# Altium project UMS.PrjPcb
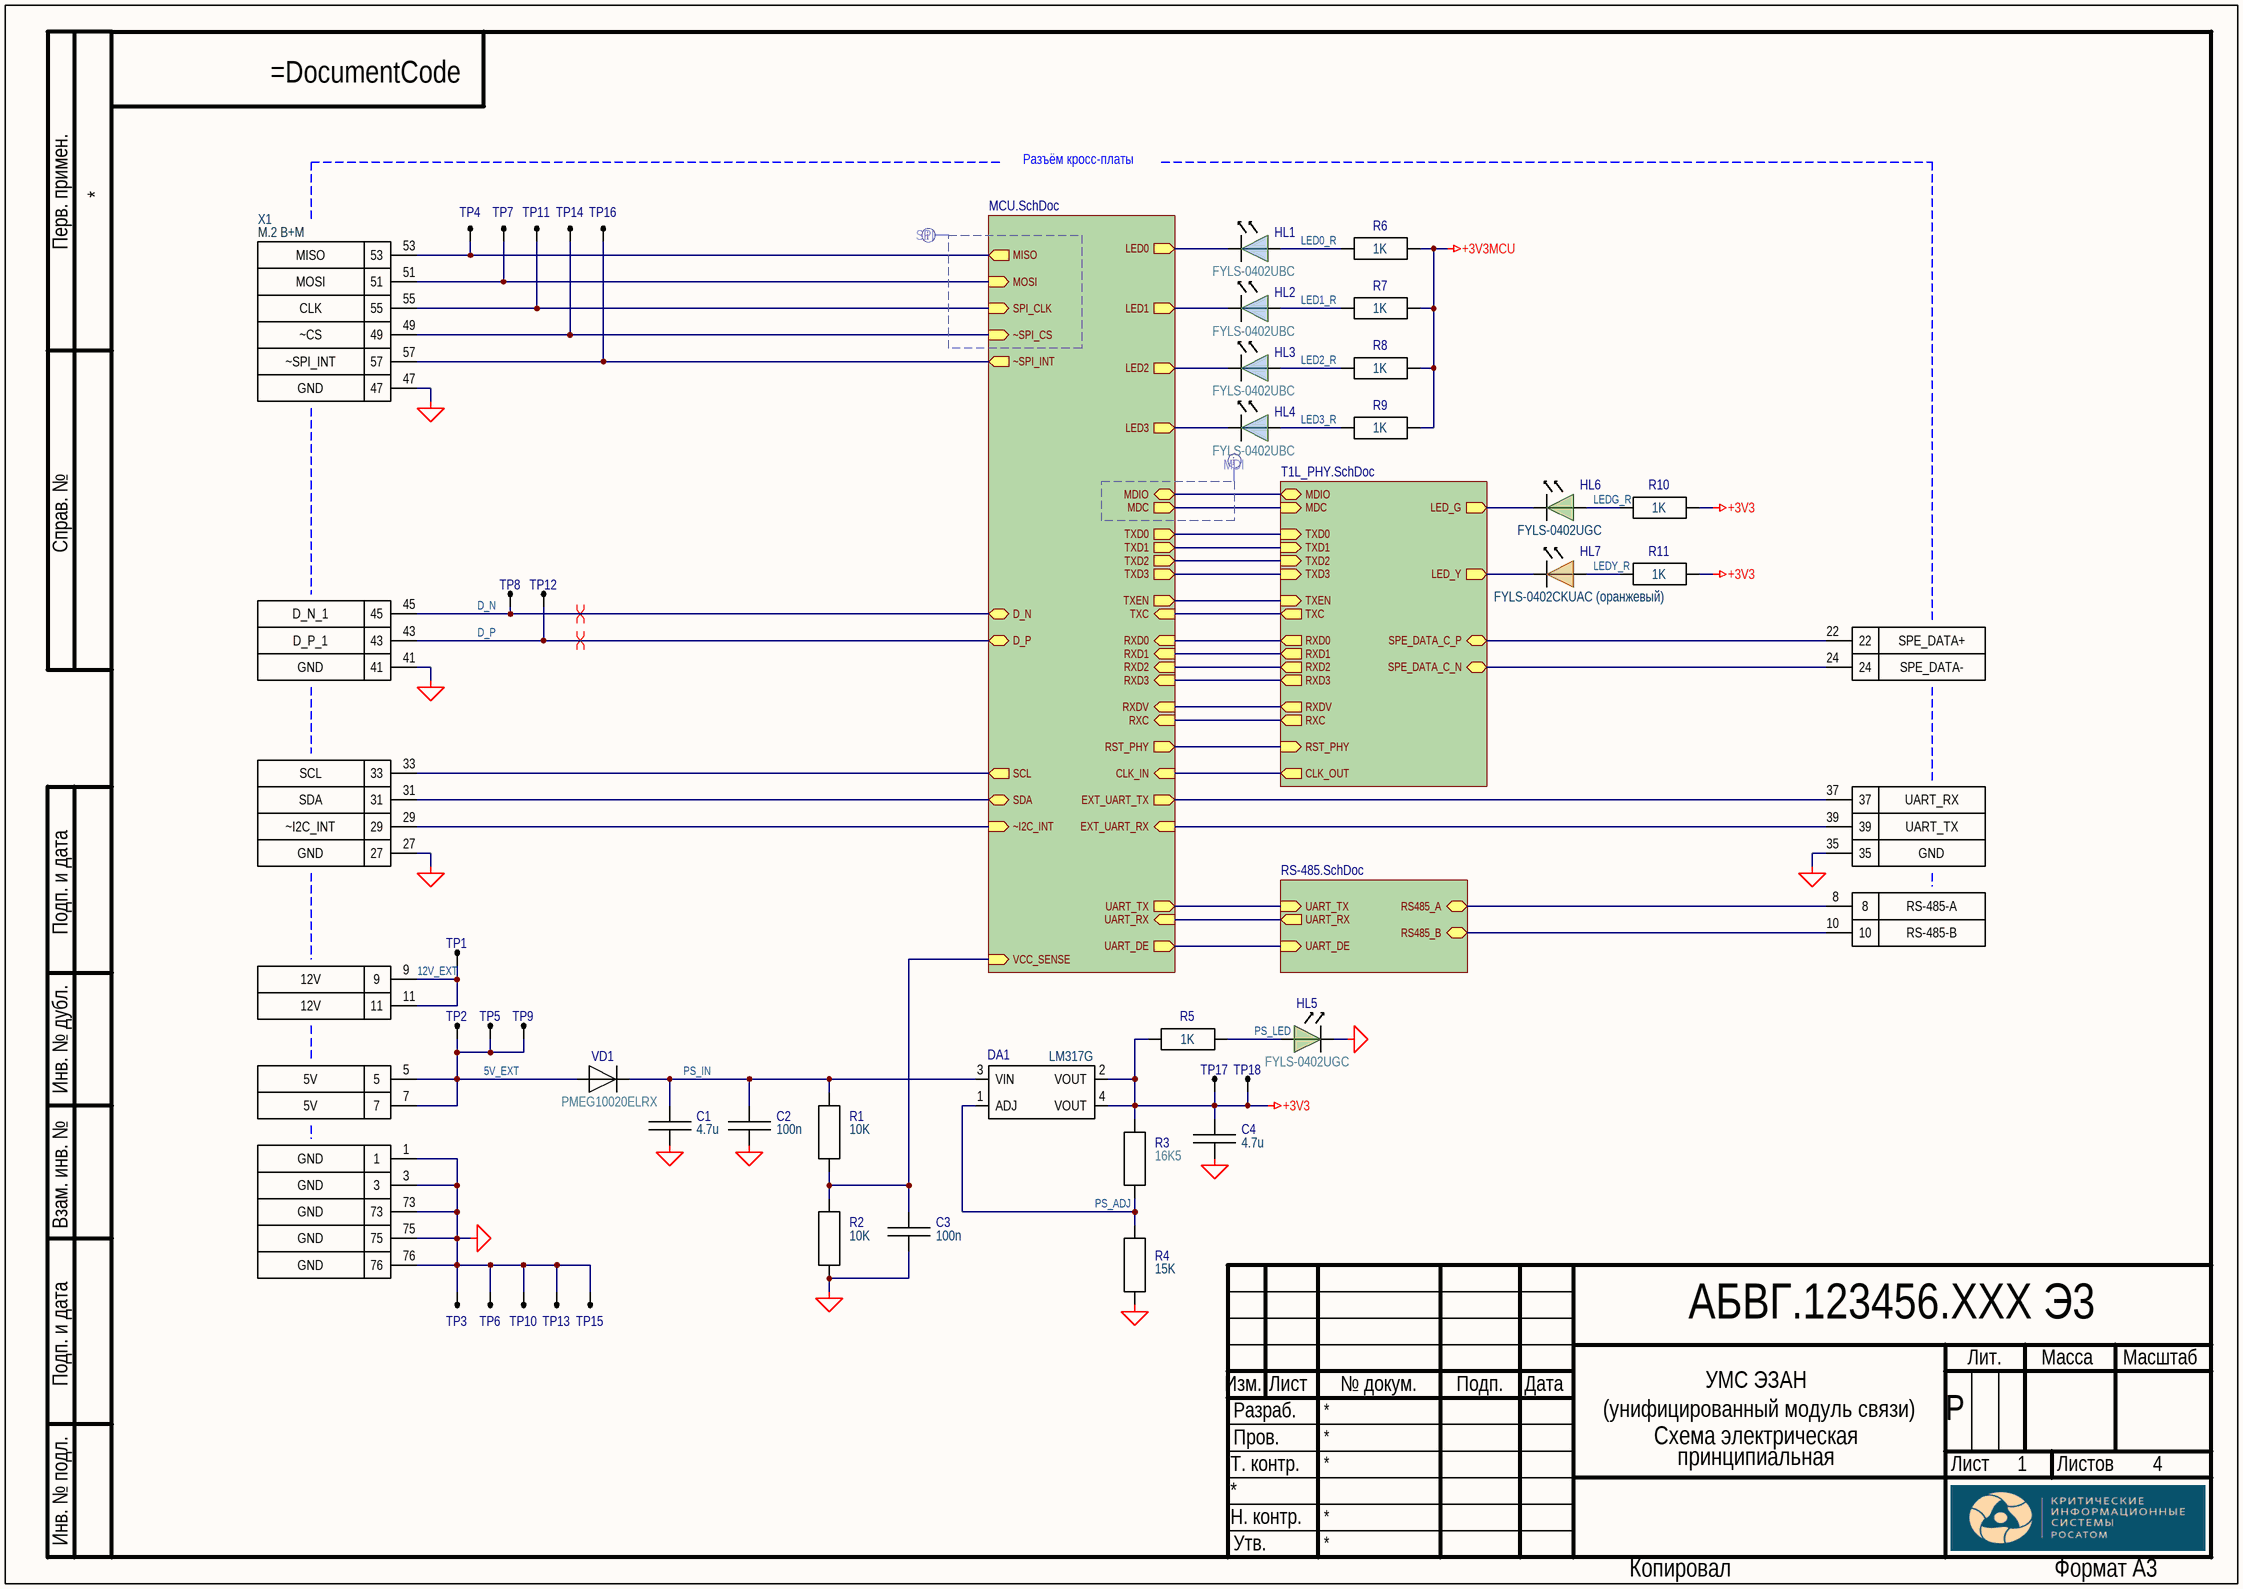
[diagram p0: Struct.SchDoc]
4 sheets, 198 parts. Net scope: hierarchical (ports join the sheet entries above them; power ports are global).
Board file: ums.PcbDoc
Sheets:
  Struct.SchDoc
    T1L = T1L_PHY.SchDoc
    RS-485 = RS-485.SchDoc
    MCU = MCU.SchDoc

## Sheet Struct.SchDoc
size 420 x 297 mm; DocumentNumber: АБВГ.123456.XXX Э3; SheetNumber: 1; SheetTotal: 4; Title1str: УМС ЭЗАН; PageSetup: Record=PageOptionsZCenterHorizontal=FalseZCenterVertical=FalseZPrintScale=0.95ZXCorrection=0.00ZYCorrection=0.00ZPrintKind=1ZBorderSize=5000000ZLeftOffset=0ZBottomOffset=0ZOrientation=1ZPaperLength=1000ZPaperWidth=1000ZScale=100ZPaperSource=15ZPrintQuality=600ZMediaType=1ZDitherType=10ZPaperKind=A4ZPrintScaleMode=1; Title2str: (унифицированный модуль связи); Letter1Column: Р; DocumentType1str: Схема электрическая; DocumentType2str: принципиальная; DocumentCode: АБВГ.123456.XXX Э3

### Parts
C1  4.7u  [C0603]
C2  100n  [C0402]
C3  100n  [C0402]
C4  4.7u  [C0603]
DA1  LM317G  [SOT-223]
HL1  FYLS-0402UBC  [LED_SMD_0402_blue]
HL2  FYLS-0402UBC  [LED_SMD_0402_blue]
HL3  FYLS-0402UBC  [LED_SMD_0402_blue]
HL4  FYLS-0402UBC  [LED_SMD_0402_blue]
HL5  FYLS-0402UGC  [LED_SMD_0402]
HL6  FYLS-0402UGC  [LED_SMD_0402]
HL7  FYLS-0402CKUAC (оранжевый)  [LED_SMD_0402_orange]
R1  10K  [R0402]
R2  10K  [R0402]
R3  16K5  [R0603]
R4  15K  [R0603]
R5  1K  [R0402]
R6  1K  [R0402]
R7  1K  [R0402]
R8  1K  [R0402]
R9  1K  [R0402]
R10  1K  [R0402]
R11  1K  [R0402]
TP1  TEST_POINT_SMD  [TEST_POINT_SMD]  (value not drawn)  (no BOM)
TP2  TEST_POINT_SMD  [TEST_POINT_SMD]  (value not drawn)  (no BOM)
TP3  TEST_POINT_1.27_STEP  [TEST_POINT_1.27_STEP]  (value not drawn)  (no BOM)
TP4  TEST_POINT_1.27_STEP  [TEST_POINT_1.27_STEP]  (value not drawn)  (no BOM)
TP5  TEST_POINT_1.27_STEP  [TEST_POINT_1.27_STEP]  (value not drawn)  (no BOM)
TP6  TEST_POINT_1.27_STEP  [TEST_POINT_1.27_STEP]  (value not drawn)  (no BOM)
TP7  TEST_POINT_1.27_STEP  [TEST_POINT_1.27_STEP]  (value not drawn)  (no BOM)
TP8  TEST_POINT_1.27_STEP  [TEST_POINT_1.27_STEP]  (value not drawn)  (no BOM)
TP9  TEST_POINT_1.27_STEP  [TEST_POINT_1.27_STEP]  (value not drawn)  (no BOM)
TP10  TEST_POINT_SMD  [TEST_POINT_SMD]  (value not drawn)  (no BOM)
TP11  TEST_POINT_1.27_STEP  [TEST_POINT_1.27_STEP]  (value not drawn)  (no BOM)
TP12  TEST_POINT_1.27_STEP  [TEST_POINT_1.27_STEP]  (value not drawn)  (no BOM)
TP13  TEST_POINT_1.27_STEP  [TEST_POINT_1.27_STEP]  (value not drawn)  (no BOM)
TP14  TEST_POINT_1.27_STEP  [TEST_POINT_1.27_STEP]  (value not drawn)  (no BOM)
TP15  TEST_POINT_1.27_STEP  [TEST_POINT_1.27_STEP]  (value not drawn)  (no BOM)
TP16  TEST_POINT_1.27_STEP  [TEST_POINT_1.27_STEP]  (value not drawn)  (no BOM)
TP17  TEST_POINT_1.27_STEP  [TEST_POINT_1.27_STEP]  (value not drawn)  (no BOM)
TP18  TEST_POINT_1.27_STEP  [TEST_POINT_1.27_STEP]  (value not drawn)  (no BOM)
VD1  PMEG10020ELRX  [SOD123W]
X1  M2_3030_M_Partial  [m2-3030-B+M]  (value not drawn)  (parts A,B,C,D,E,F,G,H,I,J,K,L,M,N,O,P,Q,R,S,T,U,V,W,X,Y,Z,27,28,29 of 29)

### Sub-sheets
MCU = MCU.SchDoc: VCC_SENSE (in), MDIO (bidir), MDC (out), RST_PHY (out), TXEN (out), TXC (in), RXDV (in), RXC (in), RXD0 (in), RXD1 (in), RXD2 (in), RXD3 (in), TXD0 (out), TXD1 (out), TXD2 (out), TXD3 (out), LED0 (out), LED3 (out), UART_TX (out), UART_RX (in), UART_DE (out), MISO (out), MOSI (in), SPI_CLK (in), ~SPI_CS (in), ~SPI_INT (out), D_N (bidir), D_P (bidir), LED1 (out), LED2 (out), CLK_IN (in), EXT_UART_TX (out), EXT_UART_RX (in), SDA (bidir), SCL (out), ~I2C_INT (in)
RS-485 = RS-485.SchDoc: RS485_A (bidir), RS485_B (bidir), UART_TX (in), UART_RX (out), UART_DE (in)
T1L = T1L_PHY.SchDoc: RST_PHY (in), LED_G (out), LED_Y (out), MDIO (bidir), MDC (in), TXEN (in), TXC (out), RXDV (out), RXC (out), SPE_DATA_C_P (bidir), SPE_DATA_C_N (bidir), RXD0 (out), RXD1 (out), RXD2 (out), RXD3 (out), TXD0 (in), TXD1 (in), TXD2 (in), TXD3 (in), CLK_OUT (out)

### Nets
+3V3: C4.1 DA1.2(VOUT) DA1.4(VOUT) R3.2 R5.1 R10.2 R11.2 TP17.1 TP18.1
+3V3MCU: R6.2 R7.2 R8.2 R9.2
GND: C1.2 C2.1 C3.1 C4.2 HL5.2 R2.1 R4.1 TP3.1 TP6.1 TP10.1 TP13.1 TP15.1 X1.1 X1.3 X1.27 X1.35 X1.41 X1.47 X1.73 X1.75 X1.76
LED_G: HL6.2 ; sheet T1L/LED_G
5V_EXT: TP2.1 TP5.1 TP9.1 VD1.2 X1.5 X1.7
12V_EXT: TP1.1 X1.9 X1.11
CLK_IN: sheet T1L/CLK_OUT, sheet MCU/CLK_IN
D_N: TP8.1 X1.45 ; sheet MCU/D_N
D_P: TP12.1 X1.43 ; sheet MCU/D_P
EXT_UART_RX: X1.39 ; sheet MCU/EXT_UART_RX
EXT_UART_TX: X1.37 ; sheet MCU/EXT_UART_TX
LED0: HL1.2 ; sheet MCU/LED0
LED0_R: HL1.1 R6.1
LED1: HL2.2 ; sheet MCU/LED1
LED1_R: HL2.1 R7.1
LED2: HL3.2 ; sheet MCU/LED2
LED2_R: HL3.1 R8.1
LED3: HL4.2 ; sheet MCU/LED3
LED3_R: HL4.1 R9.1
LED_Y: HL7.2 ; sheet T1L/LED_Y
LEDG_R: HL6.1 R10.1
LEDY_R: HL7.1 R11.1
MCURXD0: sheet T1L/RXD0, sheet MCU/RXD0
MCURXD1: sheet T1L/RXD1, sheet MCU/RXD1
MCURXD2: sheet T1L/RXD2, sheet MCU/RXD2
MCURXD3: sheet T1L/RXD3, sheet MCU/RXD3
MDC: sheet T1L/MDC, sheet MCU/MDC
MDIO: sheet T1L/MDIO, sheet MCU/MDIO
MISO: TP4.1 X1.53 ; sheet MCU/MISO
MOSI: TP7.1 X1.51 ; sheet MCU/MOSI
PS_ADJ: DA1.1(ADJ) R3.1 R4.2
PS_IN: C1.1 C2.2 DA1.3(VIN) R1.2 VD1.1
PS_LED: HL5.1 R5.2
RS485_A: X1.8 ; sheet RS-485/RS485_A
RS485_B: X1.10 ; sheet RS-485/RS485_B
RST_PHY: sheet T1L/RST_PHY, sheet MCU/RST_PHY
RXC: sheet T1L/RXC, sheet MCU/RXC
RXDV: sheet T1L/RXDV, sheet MCU/RXDV
SCL: X1.33 ; sheet MCU/SCL
SDA: X1.31 ; sheet MCU/SDA
SPE_DATA_C_N: X1.24 ; sheet T1L/SPE_DATA_C_N
SPE_DATA_C_P: X1.22 ; sheet T1L/SPE_DATA_C_P
SPI_CLK: TP11.1 X1.55 ; sheet MCU/SPI_CLK
TXC: sheet T1L/TXC, sheet MCU/TXC
TXD0: sheet T1L/TXD0, sheet MCU/TXD0
TXD1: sheet T1L/TXD1, sheet MCU/TXD1
TXD2: sheet T1L/TXD2, sheet MCU/TXD2
TXD3: sheet T1L/TXD3, sheet MCU/TXD3
TXEN: sheet T1L/TXEN, sheet MCU/TXEN
UART_DE: sheet RS-485/UART_DE, sheet MCU/UART_DE
UART_RX: sheet RS-485/UART_RX, sheet MCU/UART_RX
UART_TX: sheet RS-485/UART_TX, sheet MCU/UART_TX
VCC_SENSE: C3.2 R1.1 R2.2 ; sheet MCU/VCC_SENSE
~I2C_INT: X1.29 ; sheet MCU/~I2C_INT
~SPI_CS: TP14.1 X1.49 ; sheet MCU/~SPI_CS
~SPI_INT: TP16.1 X1.57 ; sheet MCU/~SPI_INT

### Layout directives
differential pair: D_N, D_P
net class SPI: (no net found under the mark)
net class MDI: (no net found under the mark)

### Notes on the sheet
- Разъём кросс-платы
- X1
- M.2 B+M
- Labels drawn without touching a wire or pin: =DocumentCode
- Перв. примен.
- Справ. №
- Подп. и дата
- Инв. № дубл.
- Взам. инв. №
- Изм.
- Лист
- № докум.
- Подп.
- Дата
- Лит.
- Масса
- Масштаб
- Т. контр.
- Пров.
- Разраб.
- Листов
- Инв. № подл.
- Н. контр.
- Утв.
- Копировал
- Формат А3
- (in symbol M2_3030_B+M_Partial, part A) GND
- (in symbol M2_3030_B+M_Partial, part B) RS-485-B
- (in symbol M2_3030_B+M_Partial, part C) GND
- (in symbol M2_3030_B+M_Partial, part D) RS-485-A
- (in symbol M2_3030_B+M_Partial, part E) 5V
- (in symbol M2_3030_B+M_Partial, part F) 5V
- (in symbol M2_3030_B+M_Partial, part G) 12V
- (in symbol M2_3030_B+M_Partial, part H) 12V
- (in symbol M2_3030_B+M_Partial, part I) SPE_DATA+
- (in symbol M2_3030_B+M_Partial, part J) SPE_DATA-
- (in symbol M2_3030_B+M_Partial, part K) GND
- (in symbol M2_3030_B+M_Partial, part L) D_P_1
- (in symbol M2_3030_B+M_Partial, part M) D_N_1
- (in symbol M2_3030_B+M_Partial, part N) GND
- (in symbol M2_3030_B+M_Partial, part O) ~CS
- (in symbol M2_3030_B+M_Partial, part P) MOSI
- (in symbol M2_3030_B+M_Partial, part Q) MISO
- (in symbol M2_3030_B+M_Partial, part R) ~SPI_INT
- (in symbol M2_3030_B+M_Partial, part S) GND
- (in symbol M2_3030_B+M_Partial, part T) GND
- (in symbol M2_3030_B+M_Partial, part U) CLK
- (in symbol M2_3030_B+M_Partial, part V) GND
- (in symbol M2_3030_B+M_Partial, part W) UART_TX
- (in symbol M2_3030_B+M_Partial, part X) UART_RX
- (in symbol M2_3030_B+M_Partial, part Y) GND
- (in symbol M2_3030_B+M_Partial, part Z) SCL
- (in symbol M2_3030_B+M_Partial, part 27) SDA
- (in symbol M2_3030_B+M_Partial, part 28) ~I2C_INT
- (in symbol M2_3030_B+M_Partial, part 29) GND

### Library data of the parts
C1 C4 = C0603: Чип-конденсатор 4,7 мкФ 10% 16 В X5R 0603; Manufacturer Part Number: CC0603KRX5R7BB475; Manufacturer: Yageo; TYPE: Чип-конденсатор 0603; Value: 4,7 мкФ 10% 16 В X5R; Component Type: Конденсатор
C2 C3 = C0402: Чип-конденсатор 100 нФ 10% 50 В X7R 0402; Manufacturer Part Number: CC0402KRX7R9BB104; Manufacturer: Yageo; Value: 100 нФ 10% 50 В X7R; Component Type: Конденсатор
DA1 = LM317G: LDO-регулятор SOT-223; Manufacturer: UMW; Manufacturer Part Number: LM317G; Component Type: Микросхема
HL1-HL4 = FYLS-0402UBC: Светодиод SMD 0402 прямой синий FYLS-0402UBC; Manufacturer: Foryard; Part Number: FYLS-0402UBC; Component Type: Светодиод; Manufacturer Part Number: FYLS-0402UBC
HL5 HL6 = FYLS-0402UGC: Светодиод SMD 0402 прямой зелёный FYLS-0402UGC; Manufacturer: Foryard; Manufacturer Part Number: FYLS-0402UGC; Component Type: Светодиод
HL7 = FYLS-0402CKUAC: Светодиод SMD 0402 прямой оранжевый 0402; Manufacturer: Foryard; Manufacturer Part Number: FYLS-0402CKUAC; Component Type: Светодиод
R1 R2 = R0402_1: Чип-резистор 10 кОм 1% 0402; Manufacturer Part Number: RC0402FR-0710KL; Manufacturer: Yageo; Value: 10 кОм 1%; Component Type: Резистор
R3 = R0603_3: Чип-резистор 16,5 кОм 1% 0603; Manufacturer Part Number: RC0603FR-0716K5L; Manufacturer: Yageo; TYPE: Чип-резистор 0603; Value: 16,5 кОм 1%; Component Type: Резистор
R4 = R0603_23: Чип-резистор 15 кОм 1% 0603; Manufacturer Part Number: RC0603FR-0715KL; Manufacturer: Yageo; TYPE: Чип-резистор 0603; Value: 15 кОм 1%; Component Type: Резистор
R5-R11 = R0402_4: Чип-резистор 1 кОм 1% 0402; Manufacturer Part Number: RC0402FR-071KL; Manufacturer: Yageo; Value: 1 кОм 1%; Component Type: Резистор
TP1 TP2 TP10 = TEST_POINT_SMD: Контрольная точка SMD
TP3-TP9 TP11-TP18 = TEST_POINT_1.27_STEP: Контрольная точка SMD
VD1 = PMEG10020ELRX: Диод Шоттки SOD123W; Manufacturer: Nexperia; Manufacturer Part Number: PMEG10020ELRX; Component Type: Диод
X1 = M2_3030_B+M_Partial: Parameter 1: *

## Sheet T1L_PHY.SchDoc
size 420 x 297 mm; DocumentNumber: АБВГ.123456.XXX Э3; SheetNumber: 3; SheetTotal: 4; PageSetup: Record=PageOptionsZCenterHorizontal=FalseZCenterVertical=FalseZPrintScale=0.95ZXCorrection=0.00ZYCorrection=0.00ZPrintKind=1ZBorderSize=5000000ZLeftOffset=0ZBottomOffset=0ZOrientation=1ZPaperLength=1000ZPaperWidth=1000ZScale=100ZPaperSource=15ZPrintQuality=600ZMediaType=1ZDitherType=10ZPaperKind=A4ZPrintScaleMode=1; DocumentCode: АБВГ.123456.XXX Э3
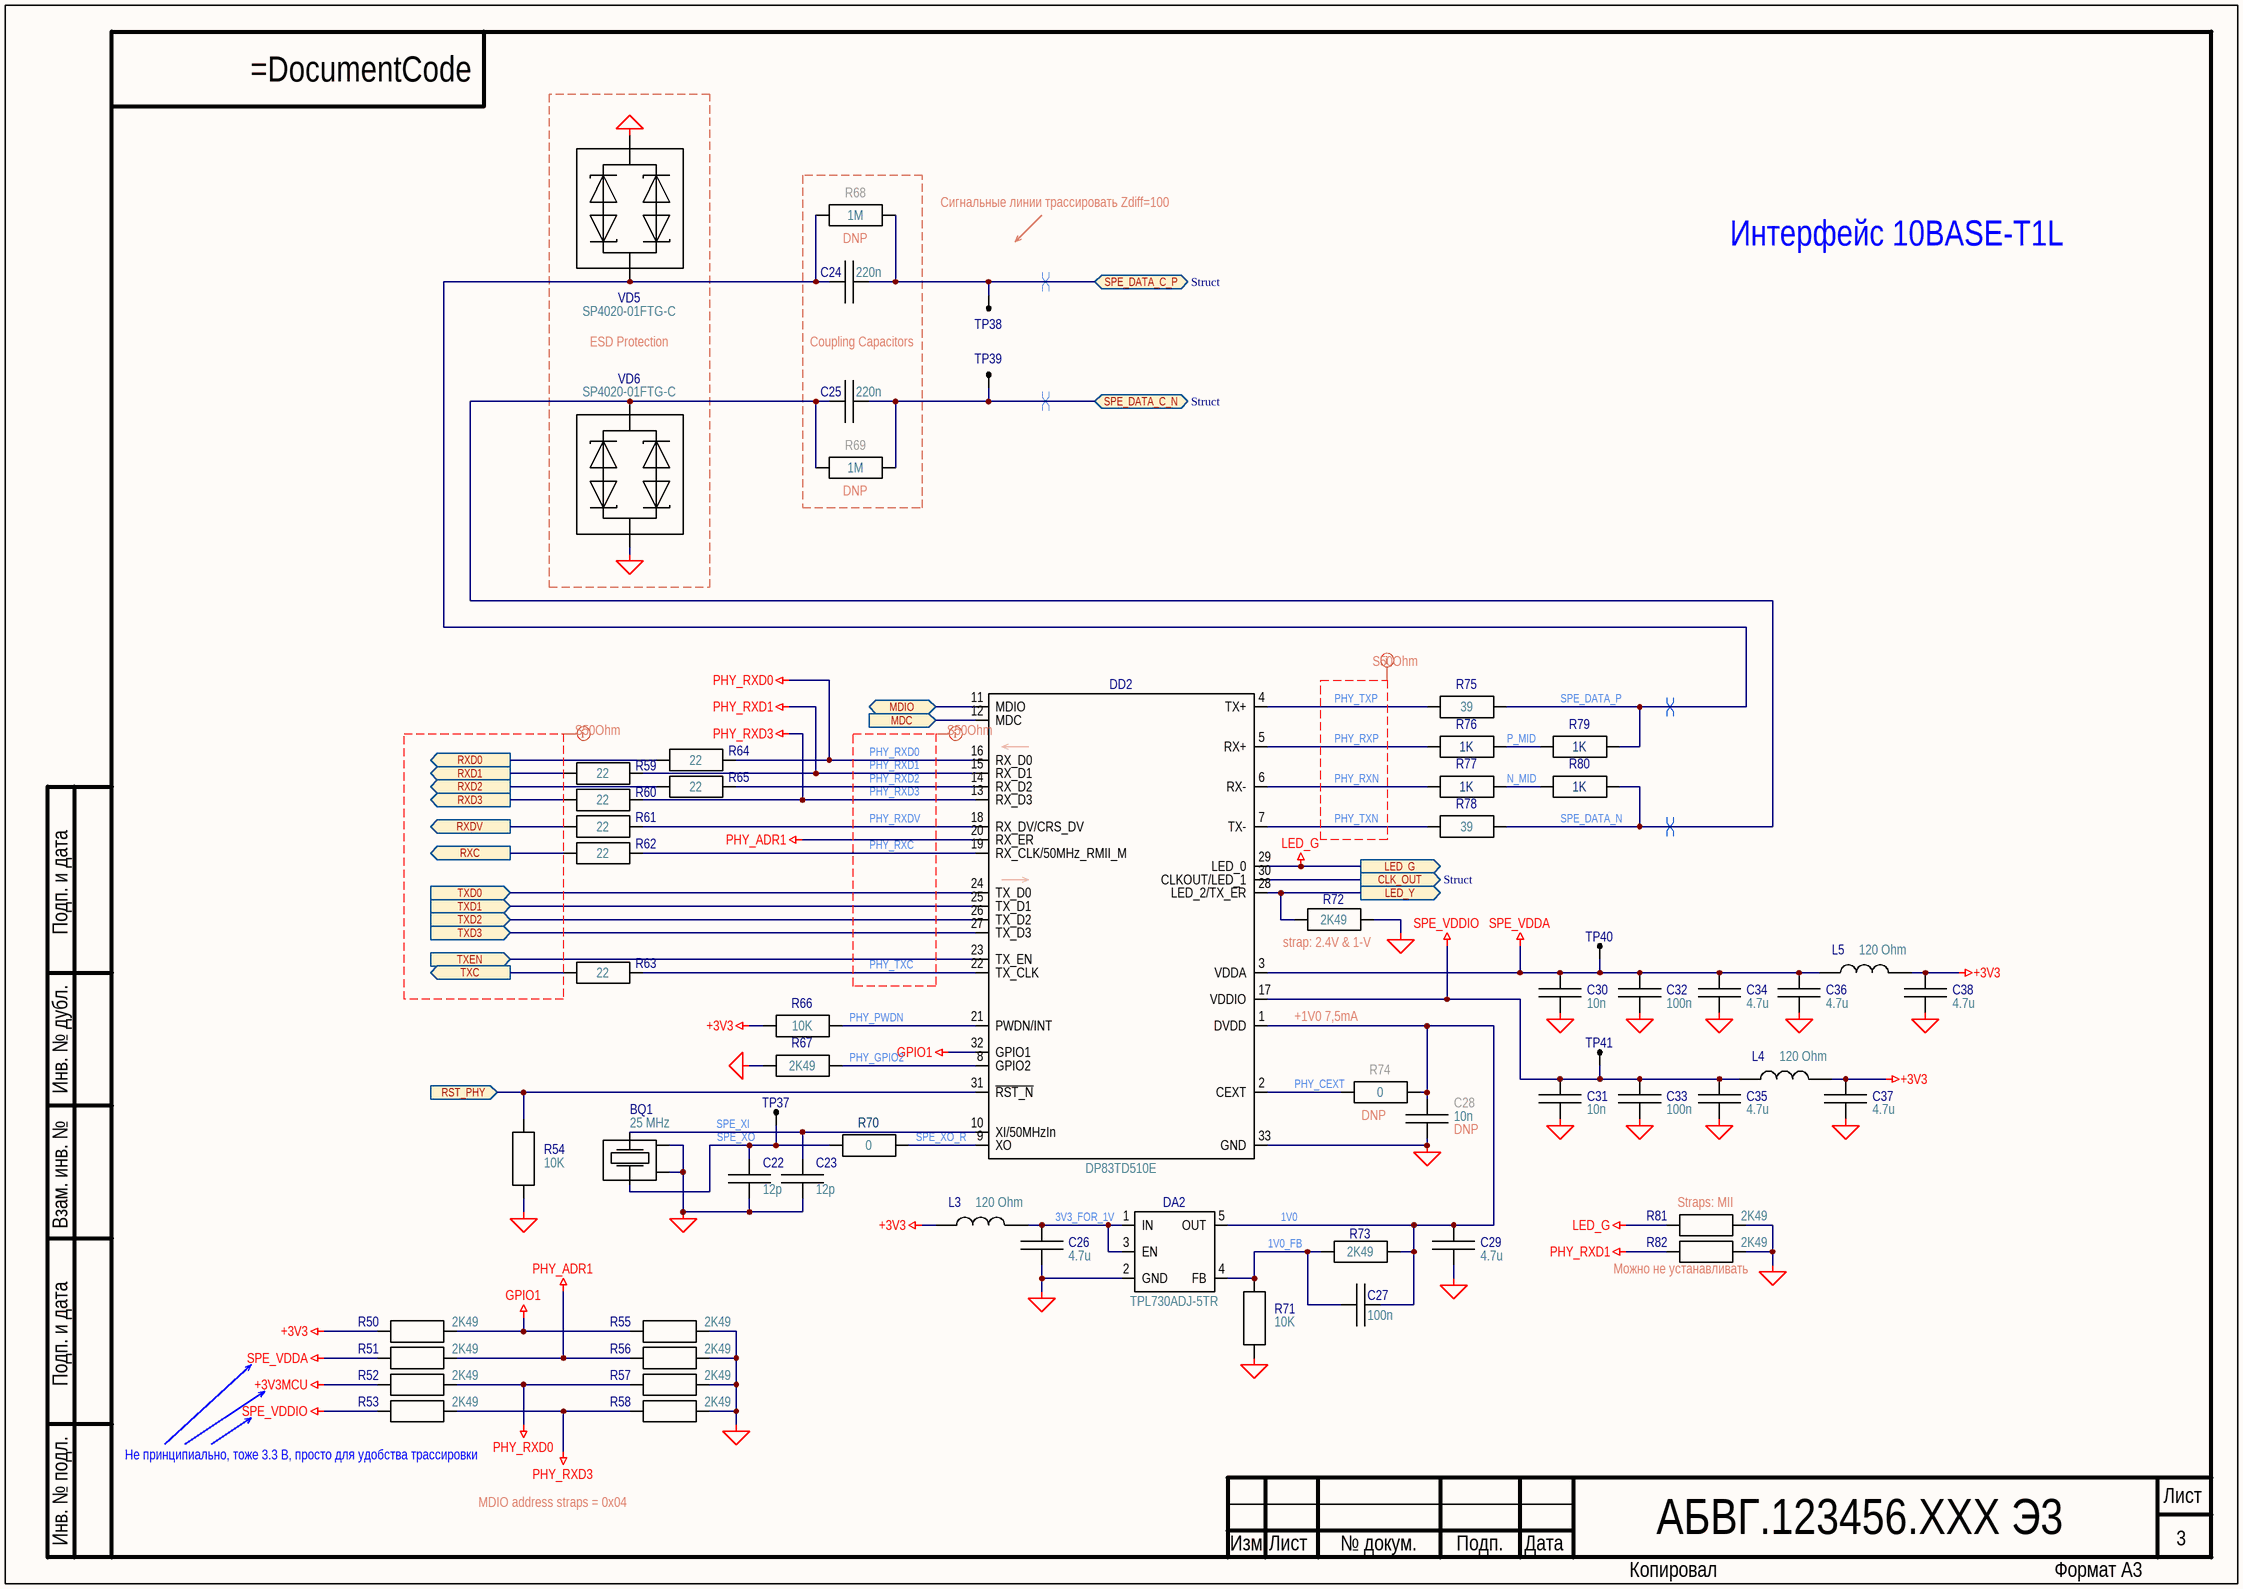
[diagram p1: T1L_PHY.SchDoc]

### Parts
BQ1  25 MHz  [DSX321G_under12MHz]
C22  12p  [C0603]
C23  12p  [C0603]
C24  220n  [C0805_rounded]
C25  220n  [C0805_rounded]
C26  4.7u  [C0603]
C27  100n  [C0402]
C28  10n  [C0402]  (no BOM)
C29  4.7u  [C0603]
C30  10n  [C0402]
C31  10n  [C0402]
C32  100n  [C0402]
C33  100n  [C0402]
C34  4.7u  [C0603]
C35  4.7u  [C0603]
C36  4.7u  [C0603]
C37  4.7u  [C0603]
C38  4.7u  [C0603]
DA2  TPL730ADJ-5TR  [SOT-23(DBV5)]
DD2  DP83TD510E  [QFN-32_ePAD_2.1x2.1]
L3  120 Ohm  [BLM18PG]
L4  120 Ohm  [BLM18PG]
L5  120 Ohm  [BLM18PG]
R50  2K49  [R0402]
R51  2K49  [R0402]
R52  2K49  [R0402]
R53  2K49  [R0402]
R54  10K  [R0402]
R55  2K49  [R0402]
R56  2K49  [R0402]
R57  2K49  [R0402]
R58  2K49  [R0402]
R59  22  [R0402]
R60  22  [R0402]
R61  22  [R0402]
R62  22  [R0402]
R63  22  [R0402]
R64  22  [R0402]
R65  22  [R0402]
R66  10K  [R0402]
R67  2K49  [R0402]
R68  1M  [R0603]  (no BOM)
R69  1M  [R0603]  (no BOM)
R70  0  [R0402]
R71  10K  [R0402]
R72  2K49  [R0402]
R73  2K49  [R0402]
R74  0  [R0402]  (no BOM)
R75  39  [R0603]
R76  1K  [R0402]
R77  1K  [R0402]
R78  39  [R0603]
R79  1K  [R0402]
R80  1K  [R0402]
R81  2K49  [R0402]
R82  2K49  [R0402]
TP37  TEST_POINT_SMD  [TEST_POINT_SMD]  (value not drawn)  (no BOM)
TP38  TEST_POINT_1.27_STEP  [TEST_POINT_1.27_STEP]  (value not drawn)  (no BOM)
TP39  TEST_POINT_1.27_STEP  [TEST_POINT_1.27_STEP]  (value not drawn)  (no BOM)
TP40  TEST_POINT_SMD  [TEST_POINT_SMD]  (value not drawn)  (no BOM)
TP41  TEST_POINT_SMD  [TEST_POINT_SMD]  (value not drawn)  (no BOM)
VD5  SP4020-01FTG-C  [SOD-323_BI]
VD6  SP4020-01FTG-C  [SOD-323_BI]

### Blocks framed on the sheet
ESD Protection: VD5 VD6

### Ports
CLK_OUT (out, see Struct), LED_G (out, see Struct), LED_Y (out, see Struct), MDC (in, see Struct, MCU), MDIO (bidir, see Struct, MCU), RST_PHY (in, see Struct, MCU), RXC (out, see Struct, MCU), RXD0 (out, see Struct, MCU), RXD1 (out, see Struct, MCU), RXD2 (out, see Struct, MCU), RXD3 (out, see Struct, MCU), RXDV (out, see Struct, MCU), SPE_DATA_C_N (bidir, see Struct), SPE_DATA_C_P (bidir, see Struct), TXC (out, see Struct, MCU), TXD0 (in, see Struct, MCU), TXD1 (in, see Struct, MCU), TXD2 (in, see Struct, MCU), TXD3 (in, see Struct, MCU), TXEN (in, see Struct, MCU)

### Nets
+3V3: C37.1 C38.1 L3.1 L4.2 L5.2 R50.1 R66.1
+3V3MCU: R52.1
GND: BQ1.2 BQ1.4 C22.2 C23.2 C26.2 C28.1 C29.2 C30.1 C31.1 C32.1 C33.1 C34.2 C35.2 C36.2 C37.2 C38.2 DA2.2(GND) DD2.33(GND) R54.1 R55.2 R56.2 R57.2 R58.2 R67.1 R71.1 R72.2 R81.2 R82.2 VD5.2 VD6.1
GPIO1: DD2.32(GPIO1) R50.2 R55.1
LED_G: DD2.29(LED_0) R81.1 ; port LED_G
PHY_ADR1: DD2.20(RX_ER) R51.2 R56.1
PHY_RXD0: DD2.16(RX_D0) R52.2 R57.1 R64.2
PHY_RXD1: DD2.15(RX_D1) R59.2 R82.1
PHY_RXD3: DD2.13(RX_D3) R53.2 R58.1 R60.2
SPE_VDDA: C30.2 C32.2 C34.1 C36.1 DD2.3(VDDA) L5.1 R51.1 TP40.1
SPE_VDDIO: C31.2 C33.2 C35.1 DD2.17(VDDIO) L4.1 R53.1 TP41.1
1V0: C27.1 C28.2 C29.1 DA2.5(OUT) DD2.1(DVDD) R73.1 R74.2
1V0_FB: C27.2 DA2.4(FB) R71.2 R73.2
3V3_FOR_1V: C26.1 DA2.1(IN) DA2.3(EN) L3.2
CLK_IN: DD2.30(CLKOUT/LED_1) ; port CLK_OUT
LED_Y: DD2.28(LED_2/TX_ER) R72.1 ; port LED_Y
MCURXD0: R64.1 ; port RXD0
MCURXD1: R59.1 ; port RXD1
MCURXD2: R65.1 ; port RXD2
MCURXD3: R60.1 ; port RXD3
MDC: DD2.12(MDC) ; port MDC
MDIO: DD2.11(MDIO) ; port MDIO
N_MID: R77.2 R80.1
P_MID: R76.2 R79.1
PHY_CEXT: DD2.2(CEXT) R74.1
PHY_GPIO2: DD2.8(GPIO2) R67.2
PHY_PWDN: DD2.21(PWDN/INT) R66.2
PHY_RXC: DD2.19(RX_CLK/50MHz_RMII_M) R62.2
PHY_RXD2: DD2.14(RX_D2) R65.2
PHY_RXDV: DD2.18(RX_DV/CRS_DV) R61.2
PHY_RXN: DD2.6(RX-) R77.1
PHY_RXP: DD2.5(RX+) R76.1
PHY_TXC: DD2.22(TX_CLK) R63.2
PHY_TXN: DD2.7(TX-) R78.1
PHY_TXP: DD2.4(TX+) R75.1
RST_PHY: DD2.31(~{RST_N}) R54.2 ; port RST_PHY
RXC: R62.1 ; port RXC
RXDV: R61.1 ; port RXDV
SPE_DATA_C_N: C25.2 R69.2 TP39.1 ; port SPE_DATA_C_N
SPE_DATA_C_P: C24.2 R68.2 TP38.1 ; port SPE_DATA_C_P
SPE_DATA_N: C25.1 R69.1 R78.2 R80.2 VD6.2
SPE_DATA_P: C24.1 R68.1 R75.2 R79.2 VD5.1
SPE_XI: BQ1.3 C23.1 DD2.10(XI/50MHzIn)
SPE_XO: BQ1.1 C22.1 R70.1 TP37.1
SPE_XO_R: DD2.9(XO) R70.2
TXC: R63.1 ; port TXC
TXD0: DD2.24(TX_D0) ; port TXD0
TXD1: DD2.25(TX_D1) ; port TXD1
TXD2: DD2.26(TX_D2) ; port TXD2
TXD3: DD2.27(TX_D3) ; port TXD3
TXEN: DD2.23(TX_EN) ; port TXEN

### Layout directives
net class S50Ohm: (no net found under the mark), PHY_RXC, PHY_RXD0, PHY_RXD1, PHY_RXD2, PHY_RXD3, PHY_RXDV, PHY_RXN, PHY_RXP, PHY_TXC, PHY_TXN, PHY_TXP
differential pair: SPE_DATA_C_N, SPE_DATA_C_P, SPE_DATA_N, SPE_DATA_P

### Notes on the sheet
- (near R68) DNP
- (near R68) Сигнальные линии трассировать Zdiff=100
- Интерфейс 10BASE-T1L
- Coupling Capacitors
- (near R69) DNP
- strap: 2.4V & 1-V
- (near DD2) +1V0 7,5mA
- (near R74) DNP
- (near C28) DNP
- (near R81) Straps: MII
- (near R82) Можно не устанавливать
- (near R53) Не принципиально, тоже 3.3 В, просто для удобства трассировки
- MDIO address straps = 0x04
- Labels drawn without touching a wire or pin: =DocumentCode
- Подп. и дата
- Инв. № дубл.
- Взам. инв. №
- Инв. № подл.
- Лист
- Изм.
- № докум.
- Подп.
- Дата
- Копировал
- Формат А3

### Library data of the parts
BQ1 = YSX321SL: Резонатор кварцевый X322525MOB4SI 25 MHz; Manufacturer: YXC; Manufacturer Part Number: X322525MOB4SI; Component Type: Резонатор кварцевый
C22 C23 = C0603: Чип-конденсатор 12 пФ 5% 50 В C0G(NP0) 0603; Manufacturer Part Number: CC0603JRNPO9BN120; Manufacturer: Yageo; TYPE: Чип-конденсатор 0603; Value: 12 пФ 5% 50 В C0G(NP0); Component Type: Конденсатор
C24 C25 = C0805_2: Чип-конденсатор 0,22 мкФ ±10% 100 В X7R 0805; Manufacturer Part Number: CC0805KKX7R0BB224; Manufacturer: Yageo; TYPE: Чип-конденсатор 0805; Value: 0,22 мкФ ±10% 100 В X7R; Component Type: Конденсатор
C26 C29 C34-C38 = C0603: as C1 on sheet Struct; Value: 4,7 мкФ 10% 16 В X5R; Component Type: Конденсатор
C27 C32 C33 = C0402: as C2 on sheet Struct; Value: 100 нФ 10% 50 В X7R; Component Type: Конденсатор
C28 C30 C31 = C0402: Чип-конденсатор 10 нФ 10% 50 В X7R 0402; Manufacturer Part Number: CC0402KRX7R9BB103; Manufacturer: Yageo; Value: 10 нФ 10% 50 В X7R; Component Type: Конденсатор
DA2 = TPL730ADJ-5TR: LDO-регулятор SOT-23-5; Manufacturer: 3PEAK; Manufacturer Part Number: TPL730ADJ-5TR; Component Type: Микросхема
DD2 = DP83TD510E: Микросхема приёмопередатчика 10Base-T1L; Manufacturer: Texas Instruments; Manufacturer Part Number: DP83TD510ERHB; Component Type: Микросхема
L3-L5 = BLM18PG121SN1D: Фильтр индуктивный 120 Ом @ 100 МГц 2 А 0603; Manufacturer: FENGHUA Advanced Technology; Manufacturer Part Number: CBM160808U121T; VALUE: 120 Ом @ 100 МГц 2 А; Component Type: Фильтр индуктивный
R50-R53 R55-R58 R81 R82 = R0402_tooth_4: Чип-резистор 2,49 кОм 1% 0402; Manufacturer Part Number: RC0402FR-072K49L; Manufacturer: Yageo; Value: 2,49 кОм 1%; Component Type: Резистор
R54 R66 R71 = R0402: Чип-резистор 10 кОм 1% 0402; Manufacturer Part Number: RC0402FR-0710KL; Manufacturer: Yageo; Value: 10 кОм 1%; Component Type: Резистор
R59-R65 = R0402_tooth_1: Чип-резистор 22 Ом 1% 0402; Manufacturer Part Number: RC0402FR-0722RL; Manufacturer: Yageo; Value: 22 Ом 1%; Component Type: Резистор
R67 R72 R73 = R0402: Чип-резистор 2,49 кОм 1% 0402; Manufacturer Part Number: RC0402FR-072K49L; Manufacturer: Yageo; Value: 2,49 кОм 1%; Component Type: Резистор
R68 R69 = R0603_13: Чип-резистор 1 МОм 1% 0603; Manufacturer Part Number: RC0603FR-071ML; Manufacturer: Yageo; Value: 1 МОм 1%; TYPE: Чип-резистор 0603; Component Type: Резистор
R70 R74 = R0402: Чип-резистор 0 ом 1% 0402; Manufacturer Part Number: RC0402FR-070RL; Manufacturer: Yageo; Value: 0 ом 1%; Component Type: Резистор
R75 R78 = R0603: Чип-резистор 39 Ом 1% 0603; Manufacturer Part Number: RC0603FR-0739RL; Manufacturer: Yageo; Value: 39 Ом 1%; TYPE: Чип-резистор 0603; Component Type: Резистор
R76 R77 R79 R80 = R0402_4: as R5 on sheet Struct; Component Type: Резистор
TP37 TP40 TP41 = TEST_POINT_SMD: Контрольная точка SMD
TP38 TP39 = TEST_POINT_1.27_STEP: Контрольная точка SMD
VD5 VD6 = SP4020-01FTG-C: TVS-диод симметричный +3V3; Manufacturer: TECH PUBLIC Co.; Manufacturer Part Number: SP4020-01FTG-C; Component Type: Сборка диодная

## Sheet RS-485.SchDoc
size 420 x 297 mm; DocumentNumber: АБВГ.123456.XXX Э3; SheetNumber: 4; SheetTotal: 4; PageSetup: Record=PageOptionsZCenterHorizontal=FalseZCenterVertical=FalseZPrintScale=0.95ZXCorrection=0.00ZYCorrection=0.00ZPrintKind=1ZBorderSize=5000000ZLeftOffset=0ZBottomOffset=0ZOrientation=1ZPaperLength=1000ZPaperWidth=1000ZScale=100ZPaperSource=15ZPrintQuality=600ZMediaType=1ZDitherType=10ZPaperKind=A4ZPrintScaleMode=1; DocumentCode: АБВГ.123456.XXX Э3
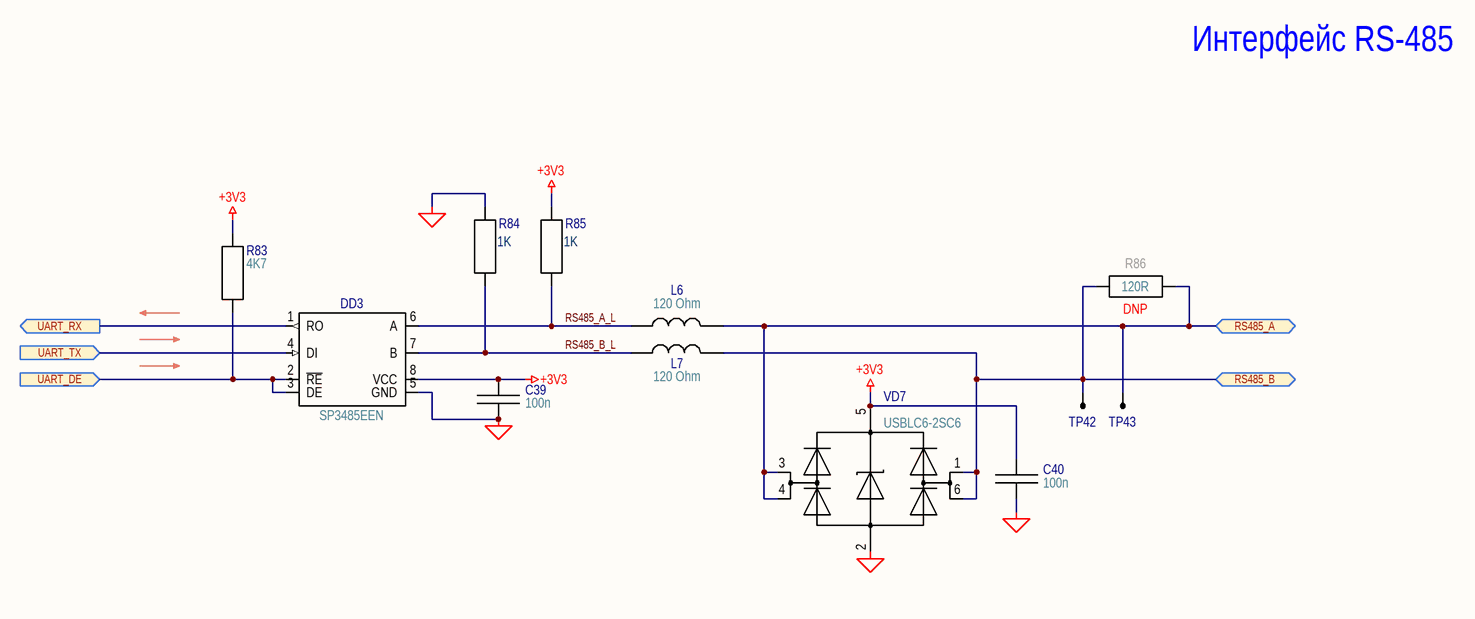
[diagram p2: RS-485.SchDoc]

### Parts
C39  100n  [C0402]
C40  100n  [C0402]
DD3  SP3485EEN  [SOP-8]
L6  120 Ohm  [BLM18PG]
L7  120 Ohm  [BLM18PG]
R83  4K7  [R0402]
R84  1K  [R0402]
R85  1K  [R0402]
R86  120R  [R0805_ROUNDED]  (no BOM)
TP42  TEST_POINT_1.27_STEP  [TEST_POINT_1.27_STEP]  (value not drawn)  (no BOM)
TP43  TEST_POINT_1.27_STEP  [TEST_POINT_1.27_STEP]  (value not drawn)  (no BOM)
VD7  USBLC6-2SC6  [SOT-23-6-USBLC-Internal-Jumpers]

### Ports
RS485_A (bidir, see Struct), RS485_B (bidir, see Struct), UART_DE (in, see Struct, MCU), UART_RX (out, see Struct, MCU), UART_TX (in, see Struct, MCU)

### Nets
+3V3: C39.2 C40.2 DD3.8(VCC) R83.2 R85.2 VD7.5
GND: C39.1 C40.1 DD3.5(GND) R84.2 VD7.2
RS485_A: L6.2 R86.2 TP43.1 VD7.3 VD7.4 ; port RS485_A
RS485_A_L: DD3.6(A) L6.1 R85.1
RS485_B: L7.2 R86.1 TP42.1 VD7.1 VD7.6 ; port RS485_B
RS485_B_L: DD3.7(B) L7.1 R84.1
UART_DE: DD3.2(~{RE}) DD3.3(DE) R83.1 ; port UART_DE
UART_RX: DD3.1(RO) ; port UART_RX
UART_TX: DD3.4(DI) ; port UART_TX

### Notes on the sheet
- Интерфейс RS-485
- (near R86) DNP
- Labels drawn without touching a wire or pin: =DocumentCode
- Подп. и дата
- Инв. № дубл.
- Взам. инв. №
- Инв. № подл.
- Лист
- Изм.
- № докум.
- Подп.
- Дата
- Копировал
- Формат А3

### Library data of the parts
C39 C40 = C0402: as C2 on sheet Struct; Value: 100 нФ 10% 50 В X7R; Component Type: Конденсатор
DD3 = SP3485EEN: Трансивер RS-485 SP3485EEN; Manufacturer: UMW; Manufacturer Part Number: SP3485EEN; Component Type: Микросхема
L6 L7 = BLM18PG121SN1D: as L3 on sheet T1L_PHY; VALUE: 120 Ом @ 100 МГц 2 А; Component Type: Фильтр индуктивный
R83 = R0402: Чип-резистор 4,7 кОм 1% 0402; Manufacturer Part Number: RC0402FR-074K7L; Manufacturer: Yageo; Value: 4,7 кОм 1%; Component Type: Резистор
R84 R85 = R0402_4: as R5 on sheet Struct; Component Type: Резистор
R86 = R0805: Чип-резистор 120 Ом 1% 0805; Manufacturer Part Number: RC0805FR-07120RL; Manufacturer: Yageo; TYPE: Чип-резистор 0805; Value: 120 Ом 1%; Component Type: Резистор
TP42 TP43 = TEST_POINT_1.27_STEP: Контрольная точка SMD
VD7 = USBLC6-2SC6: Диодная сборка ESD защиты USBLC6-2SC6; Manufacturer: UMW; Manufacturer Part Number: USBLC6-2SC6; Component Type: Сборка диодная

## Sheet MCU.SchDoc
size 420 x 297 mm; DocumentNumber: АБВГ.123456.XXX Э3; SheetNumber: 2; SheetTotal: 4; PageSetup: Record=PageOptionsZCenterHorizontal=FalseZCenterVertical=FalseZPrintScale=0.95ZXCorrection=0.00ZYCorrection=0.00ZPrintKind=1ZBorderSize=5000000ZLeftOffset=0ZBottomOffset=0ZOrientation=1ZPaperLength=1000ZPaperWidth=1000ZScale=100ZPaperSource=15ZPrintQuality=600ZMediaType=1ZDitherType=10ZPaperKind=A4ZPrintScaleMode=1; DocumentCode: АБВГ.123456.XXX Э3
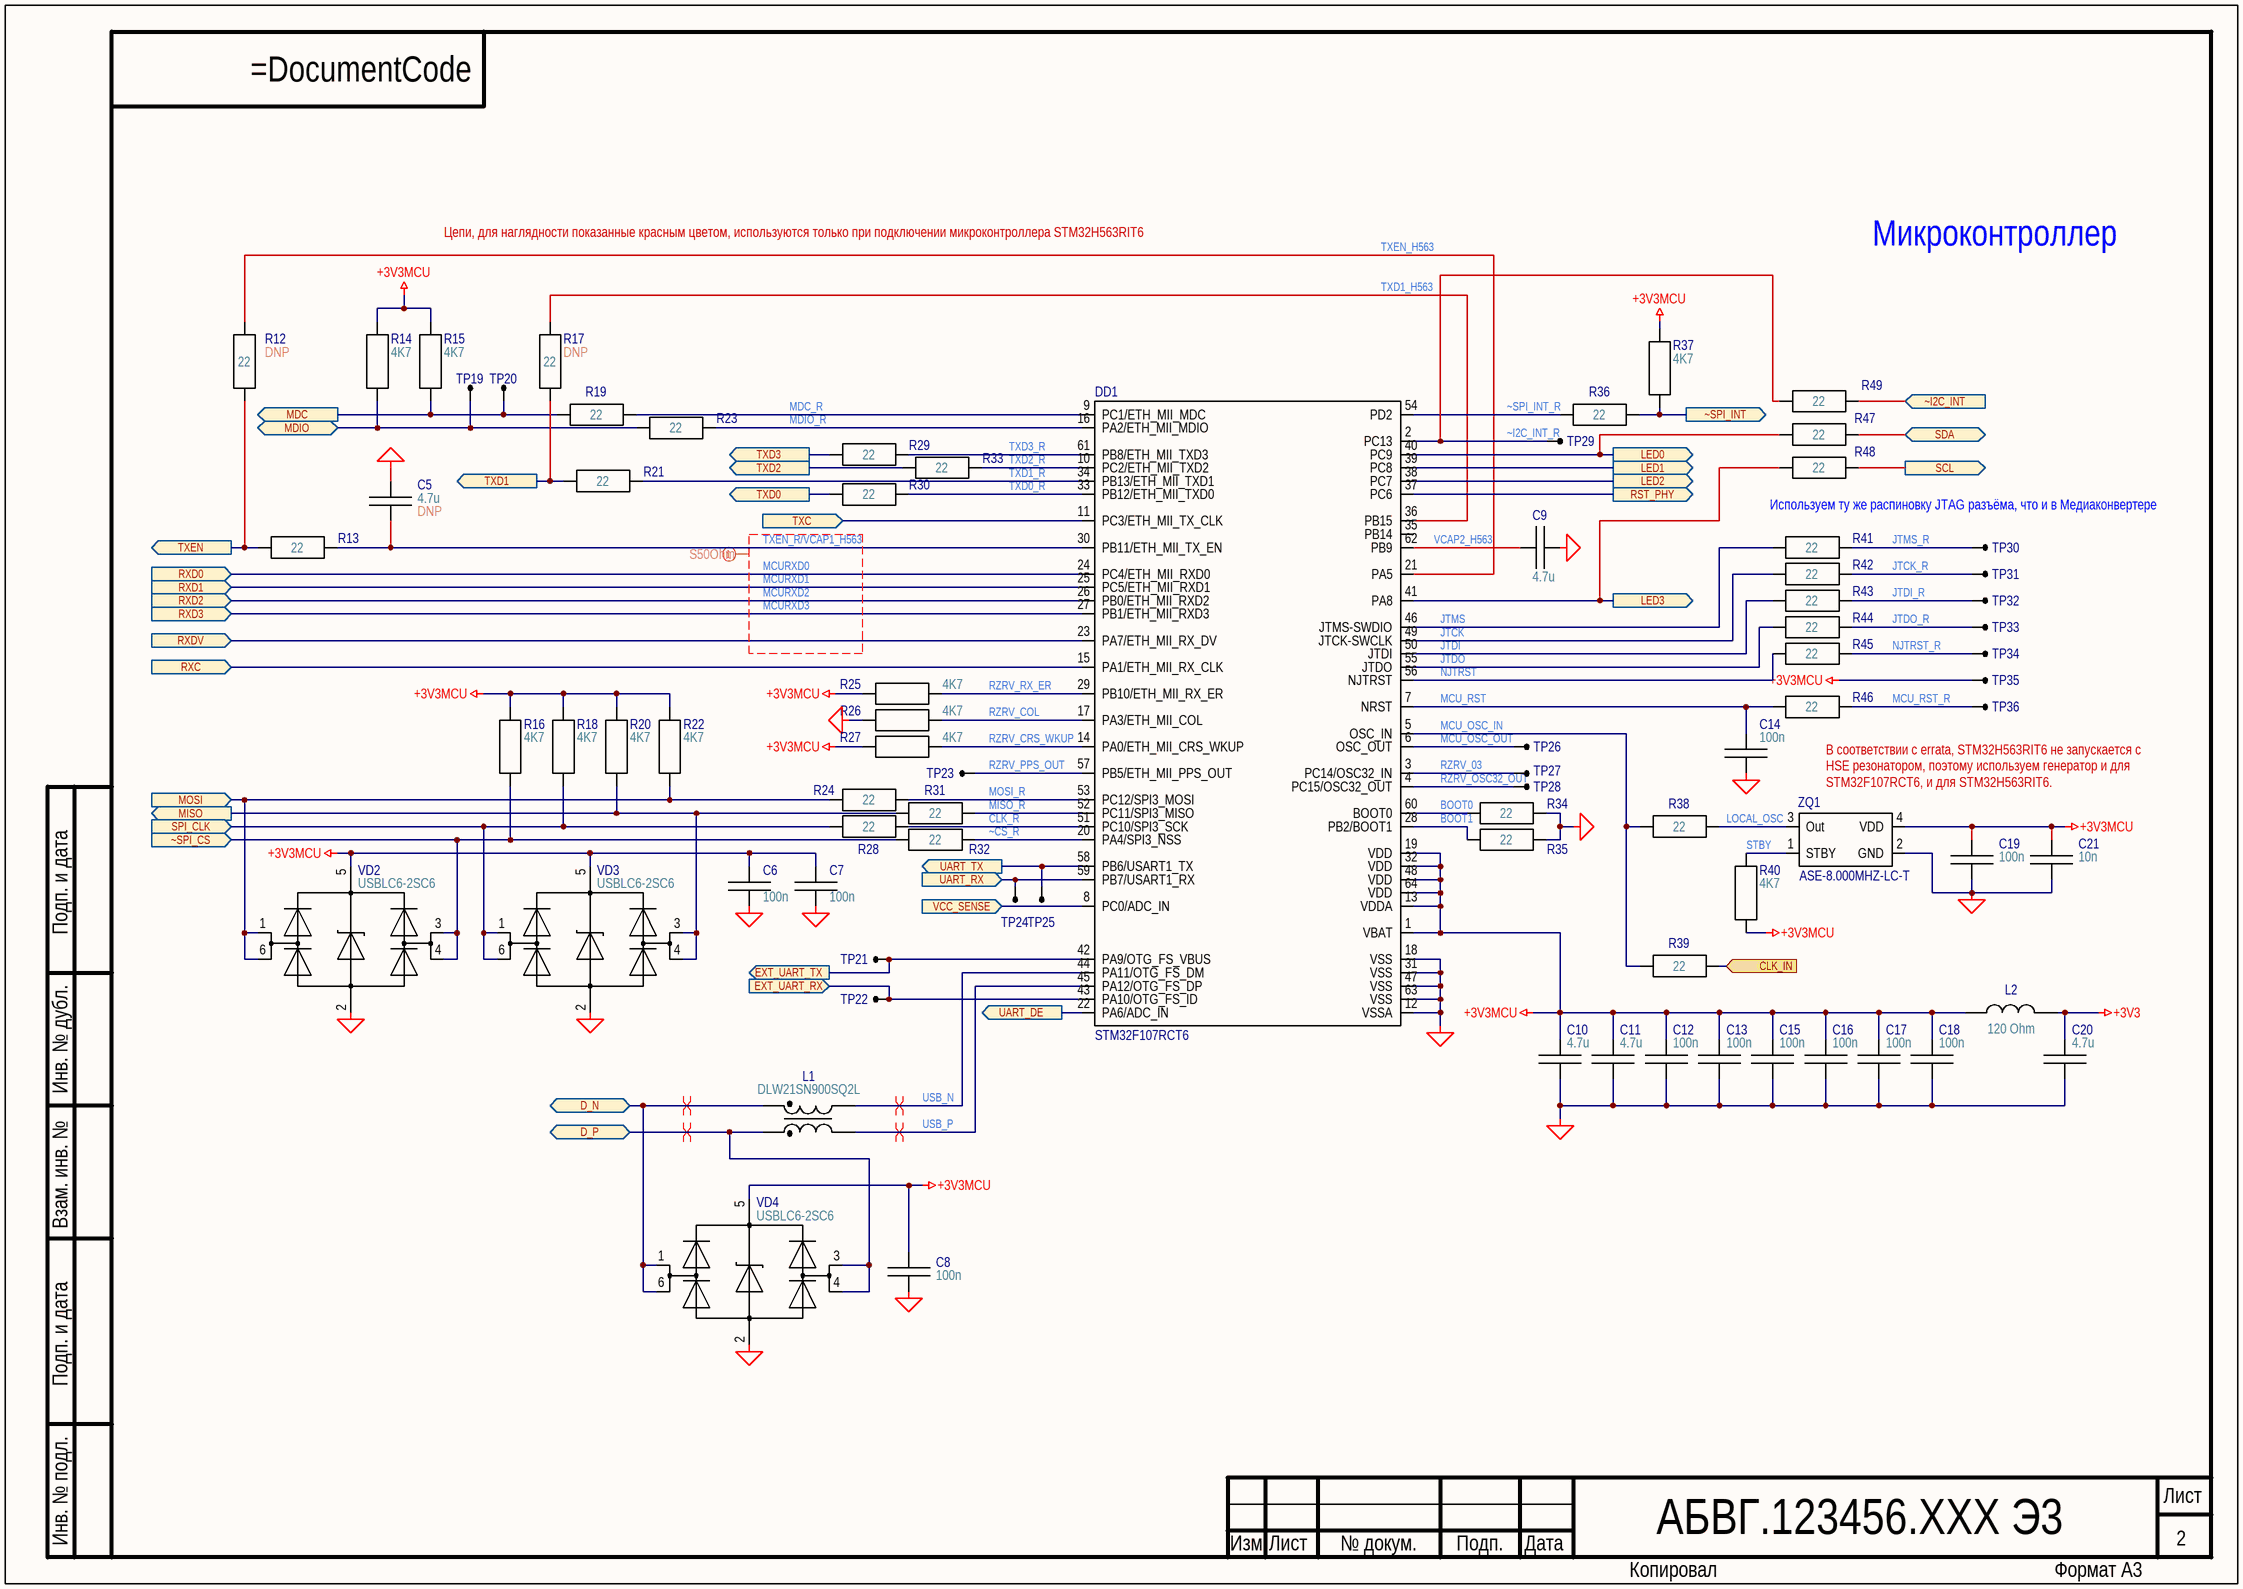
[diagram p3: MCU.SchDoc]

### Parts
C5  4.7u  [C0603]
C6  100n  [C0402]
C7  100n  [C0402]
C8  100n  [C0402]
C9  4.7u  [C0603]
C10  4.7u  [C0603]
C11  4.7u  [C0603]
C12  100n  [C0402]
C13  100n  [C0402]
C14  100n  [C0402]
C15  100n  [C0402]
C16  100n  [C0402]
C17  100n  [C0402]
C18  100n  [C0402]
C19  100n  [C0402]
C20  4.7u  [C0603]
C21  10n  [C0402]
DD1  STM32F107RCT6  [LQFP-64-STM-Microcontroller]
L1  DLW21SN900SQ2L  [DLW21S]
L2  120 Ohm  [BLM18PG]
R12  22  [R0402]
R13  22  [R0402]
R14  4K7  [R0402]
R15  4K7  [R0402]
R16  4K7  [R0402]
R17  22  [R0402]
R18  4K7  [R0402]
R19  22  [R0402]
R20  4K7  [R0402]
R21  22  [R0402]
R22  4K7  [R0402]
R23  22  [R0402]
R24  22  [R0402]
R25  4K7  [R0402]
R26  4K7  [R0402]
R27  4K7  [R0402]
R28  22  [R0402]
R29  22  [R0402]
R30  22  [R0402]
R31  22  [R0402]
R32  22  [R0402]
R33  22  [R0402]
R34  22  [R0402]
R35  22  [R0402]
R36  22  [R0402]
R37  4K7  [R0402]
R38  22  [R0402]
R39  22  [R0402]
R40  4K7  [R0402]
R41  22  [R0402]
R42  22  [R0402]
R43  22  [R0402]
R44  22  [R0402]
R45  22  [R0402]
R46  22  [R0402]
R47  22  [R0402]
R48  22  [R0402]
R49  22  [R0402]
TP19  TEST_POINT_1.27_STEP  [TEST_POINT_1.27_STEP]  (value not drawn)  (no BOM)
TP20  TEST_POINT_1.27_STEP  [TEST_POINT_1.27_STEP]  (value not drawn)  (no BOM)
TP21  TEST_POINT_1.27_STEP  [TEST_POINT_1.27_STEP]  (value not drawn)  (no BOM)
TP22  TEST_POINT_1.27_STEP  [TEST_POINT_1.27_STEP]  (value not drawn)  (no BOM)
TP23  TEST_POINT_SMD  [TEST_POINT_SMD]  (value not drawn)  (no BOM)
TP24  TEST_POINT_SMD  [TEST_POINT_SMD]  (value not drawn)  (no BOM)
TP25  TEST_POINT_SMD  [TEST_POINT_SMD]  (value not drawn)  (no BOM)
TP26  TEST_POINT_SMD  [TEST_POINT_SMD]  (value not drawn)  (no BOM)
TP27  TEST_POINT_SMD  [TEST_POINT_SMD]  (value not drawn)  (no BOM)
TP28  TEST_POINT_SMD  [TEST_POINT_SMD]  (value not drawn)  (no BOM)
TP29  TEST_POINT_SMD  [TEST_POINT_SMD]  (value not drawn)  (no BOM)
TP30  TEST_POINT_1.27_STEP  [TEST_POINT_1.27_STEP]  (value not drawn)  (no BOM)
TP31  TEST_POINT_1.27_STEP  [TEST_POINT_1.27_STEP]  (value not drawn)  (no BOM)
TP32  TEST_POINT_1.27_STEP  [TEST_POINT_1.27_STEP]  (value not drawn)  (no BOM)
TP33  TEST_POINT_1.27_STEP  [TEST_POINT_1.27_STEP]  (value not drawn)  (no BOM)
TP34  TEST_POINT_1.27_STEP  [TEST_POINT_1.27_STEP]  (value not drawn)  (no BOM)
TP35  TEST_POINT_1.27_STEP  [TEST_POINT_1.27_STEP]  (value not drawn)  (no BOM)
TP36  TEST_POINT_1.27_STEP  [TEST_POINT_1.27_STEP]  (value not drawn)  (no BOM)
VD2  USBLC6-2SC6  [SOT-23-6-USBLC-Internal-Jumpers]
VD3  USBLC6-2SC6  [SOT-23-6-USBLC-Internal-Jumpers]
VD4  USBLC6-2SC6  [SOT-23-6-USBLC-Internal-Jumpers]
ZQ1  ASE-8.000MHZ-LC-T  [ASE-X.XXXMHz]

### Ports
CLK_IN (in, see Struct), D_N (bidir, see Struct), D_P (bidir, see Struct), EXT_UART_RX (in, see Struct), EXT_UART_TX (out, see Struct), LED0 (out, see Struct), LED1 (out, see Struct), LED2 (out, see Struct), LED3 (out, see Struct), MDC (out, see Struct, T1L_PHY), MDIO (bidir, see Struct, T1L_PHY), MISO (out, see Struct), MOSI (in, see Struct), RST_PHY (out, see Struct, T1L_PHY), RXC (in, see Struct, T1L_PHY), RXD0 (in, see Struct, T1L_PHY), RXD1 (in, see Struct, T1L_PHY), RXD2 (in, see Struct, T1L_PHY), RXD3 (in, see Struct, T1L_PHY), RXDV (in, see Struct, T1L_PHY), SCL (out, see Struct), SDA (bidir, see Struct), SPI_CLK (in, see Struct), TXC (in, see Struct, T1L_PHY), TXD0 (out, see Struct, T1L_PHY), TXD1 (out, see Struct, T1L_PHY), TXD2 (out, see Struct, T1L_PHY), TXD3 (out, see Struct, T1L_PHY), TXEN (out, see Struct, T1L_PHY), UART_DE (out, see Struct, RS-485), UART_RX (in, see Struct, RS-485), UART_TX (out, see Struct, RS-485), VCC_SENSE (in, see Struct), ~I2C_INT (in, see Struct), ~SPI_CS (in, see Struct), ~SPI_INT (out, see Struct)

### Nets
+3V3: C20.1 L2.2
+3V3MCU: C6.2 C7.2 C8.2 C10.1 C11.1 C12.2 C13.2 C15.2 C16.2 C17.2 C18.2 C19.2 C21.2 DD1.1(VBAT) DD1.13(VDDA) DD1.19(VDD) DD1.32(VDD) DD1.48(VDD) DD1.64(VDD) L2.1 R14.2 R15.2 R16.2 R18.2 R20.2 R22.2 R25.2 R27.2 R37.2 R40.1 TP35.1 VD2.5 VD3.5 VD4.5 ZQ1.4(VDD)
GND: C5.1 C6.1 C7.1 C8.1 C9.2 C10.2 C11.2 C12.1 C13.1 C14.1 C15.1 C16.1 C17.1 C18.1 C19.1 C20.2 C21.1 DD1.12(VSSA) DD1.18(VSS) DD1.31(VSS) DD1.47(VSS) DD1.63(VSS) R26.2 R34.1 R35.1 VD2.2 VD3.2 VD4.2 ZQ1.2(GND)
BOOT0: DD1.60(BOOT0) R34.2
BOOT1: DD1.28(PB2/BOOT1) R35.2
CLK_IN: R39.1 ; port CLK_IN
CLK_R: DD1.51(PC10/SPI3_SCK) R28.1
D_N: L1.1 VD4.1 VD4.6 ; port D_N
D_P: L1.4 VD4.3 VD4.4 ; port D_P
EXT_UART_RX: DD1.43(PA10/OTG_FS_ID) TP22.1 ; port EXT_UART_RX
EXT_UART_TX: DD1.42(PA9/OTG_FS_VBUS) TP21.1 ; port EXT_UART_TX
JTCK: DD1.49(JTCK-SWCLK) R42.2
JTCK_R: R42.1 TP31.1
JTDI: DD1.50(JTDI) R43.2
JTDI_R: R43.1 TP32.1
JTDO: DD1.55(JTDO) R44.2
JTDO_R: R44.1 TP33.1
JTMS: DD1.46(JTMS-SWDIO) R41.2
JTMS_R: R41.1 TP30.1
LED0: DD1.40(PC9) R47.2 ; port LED0
LED1: DD1.39(PC8) ; port LED1
LED2: DD1.38(PC7) ; port LED2
LED3: DD1.41(PA8) R48.2 ; port LED3
LOCAL_OSC: R38.1 ZQ1.3(Out)
MCU_OSC_IN: DD1.5(OSC_IN) R38.2 R39.2
MCU_OSC_OUT: DD1.6(OSC_OUT) TP26.1
MCU_RST: C14.2 DD1.7(NRST) R46.2
MCU_RST_R: R46.1 TP36.1
MCURXD0: DD1.24(PC4/ETH_MII_RXD0) ; port RXD0
MCURXD1: DD1.25(PC5/ETH_MII_RXD1) ; port RXD1
MCURXD2: DD1.26(PB0/ETH_MII_RXD2) ; port RXD2
MCURXD3: DD1.27(PB1/ETH_MII_RXD3) ; port RXD3
MDC: R15.1 R19.2 TP20.1 ; port MDC
MDC_R: DD1.9(PC1/ETH_MII_MDC) R19.1
MDIO: R14.1 R23.2 TP19.1 ; port MDIO
MDIO_R: DD1.16(PA2/ETH_MII_MDIO) R23.1
MISO: R20.1 R31.2 VD3.3 VD3.4 ; port MISO
MISO_R: DD1.52(PC11/SPI3_MISO) R31.1
MOSI: R22.1 R24.2 VD2.1 VD2.6 ; port MOSI
MOSI_R: DD1.53(PC12/SPI3_MOSI) R24.1
NJTRST: DD1.56(NJTRST) R45.2
NJTRST_R: R45.1 TP34.1
RST_PHY: DD1.37(PC6) ; port RST_PHY
RXC: DD1.15(PA1/ETH_MII_RX_CLK) ; port RXC
RXDV: DD1.23(PA7/ETH_MII_RX_DV) ; port RXDV
RZRV_03: DD1.3(PC14/OSC32_IN) TP27.1
RZRV_COL: DD1.17(PA3/ETH_MII_COL) R26.1
RZRV_CRS_WKUP: DD1.14(PA0/ETH_MII_CRS_WKUP) R27.1
RZRV_OSC32_OUT: DD1.4(PC15/OSC32_OUT) TP28.1
RZRV_PPS_OUT: DD1.57(PB5/ETH_MII_PPS_OUT) TP23.1
RZRV_RX_ER: DD1.29(PB10/ETH_MII_RX_ER) R25.1
SCL: R48.1 ; port SCL
SDA: R47.1 ; port SDA
SPI_CLK: R18.1 R28.2 VD3.1 VD3.6 ; port SPI_CLK
STBY: R40.2 ZQ1.1(STBY)
TXC: DD1.11(PC3/ETH_MII_TX_CLK) ; port TXC
TXD0: R30.2 ; port TXD0
TXD0_R: DD1.33(PB12/ETH_MII_TXD0) R30.1
TXD1: R17.1 R21.2 ; port TXD1
TXD1_H563: DD1.36(PB15) R17.2
TXD1_R: DD1.34(PB13/ETH_MII_TXD1) R21.1
TXD2: R33.2 ; port TXD2
TXD2_R: DD1.10(PC2/ETH_MII_TXD2) R33.1
TXD3: R29.2 ; port TXD3
TXD3_R: DD1.61(PB8/ETH_MII_TXD3) R29.1
TXEN: R12.1 R13.1 ; port TXEN
TXEN_H563: DD1.21(PA5) R12.2
TXEN_R/VCAP1_H563: C5.2 DD1.30(PB11/ETH_MII_TX_EN) R13.2
UART_DE: DD1.22(PA6/ADC_IN) ; port UART_DE
UART_RX: DD1.59(PB7/USART1_RX) TP24.1 ; port UART_RX
UART_TX: DD1.58(PB6/USART1_TX) TP25.1 ; port UART_TX
USB_N: DD1.44(PA11/OTG_FS_DM) L1.2
USB_P: DD1.45(PA12/OTG_FS_DP) L1.3
VCAP2_H563: C9.1 DD1.62(PB9)
VCC_SENSE: DD1.8(PC0/ADC_IN) ; port VCC_SENSE
~CS_R: DD1.20(PA4/SPI3_NSS) R32.1
~I2C_INT: R49.1 ; port ~I2C_INT
~I2C_INT_R: DD1.2(PC13) R49.2 TP29.1
~SPI_CS: R16.1 R32.2 VD2.3 VD2.4 ; port ~SPI_CS
~SPI_INT: R36.1 R37.1 ; port ~SPI_INT
~SPI_INT_R: DD1.54(PD2) R36.2

Not connected (* = marked no-connect by the designer): DD1 35(PB14)

### Layout directives
differential pair: D_N, D_P, USB_N, USB_P
net class S50Ohm: MCURXD0, MCURXD1, MCURXD2, MCURXD3, TXEN_R/VCAP1_H563

### Notes on the sheet
- Цепи, для наглядности показанные красным цветом, используются только при подключении микроконтроллера STM32H563RIT6
- Микроконтроллер
- (near R12) DNP
- (near R17) DNP
- (near C5) DNP
- Используем ту же распиновку JTAG разъёма, что и в Медиаконвертере
- В соответствии с errata, STM32H563RIT6 не запускается с HSE резонатором, поэтому используем генератор и для STM32F107RCT6, и для STM32H563RIT6.
- Labels drawn without touching a wire or pin: =DocumentCode
- Подп. и дата
- Инв. № дубл.
- Взам. инв. №
- Инв. № подл.
- Лист
- Изм.
- № докум.
- Подп.
- Дата
- Копировал
- Формат А3

### Library data of the parts
C5 C9-C11 C20 = C0603: as C1 on sheet Struct; Value: 4,7 мкФ 10% 16 В X5R; Component Type: Конденсатор
C6-C8 C12-C19 = C0402: as C2 on sheet Struct; Value: 100 нФ 10% 50 В X7R; Component Type: Конденсатор
C21 = C0402: as C28 on sheet T1L_PHY; Value: 10 нФ 10% 50 В X7R; Component Type: Конденсатор
DD1 = STM32F107RCT6: Микроконтроллер ARM; Manufacturer: ST Microelectronics; Component Type: Микроконтроллер; Manufacturer Part Number: STM32F107RCT6
L1 = DLW21SN900SQ2L: Фильтр синфазный DLW21SN900SQ2L; Manufacturer: Murata; Manufacturer Part Number: DLW21SN900SQ2L; Component Type: Фильтр синфазный
L2 = BLM18PG121SN1D: as L3 on sheet T1L_PHY; VALUE: 120 Ом @ 100 МГц 2 А; Component Type: Фильтр индуктивный
R12 R13 R17 R19 R21 R23 R24 R28-R36 R38 R39 R41-R49 = R0402_tooth_1: as R59 on sheet T1L_PHY; Component Type: Резистор
R14-R16 R18 R20 R22 R25-R27 R37 R40 = R0402: as R83 on sheet RS-485; Value: 4,7 кОм 1%; Component Type: Резистор
TP19-TP22 TP30-TP36 = TEST_POINT_1.27_STEP: Контрольная точка SMD
TP23-TP29 = TEST_POINT_SMD: Контрольная точка SMD
VD2-VD4 = USBLC6-2SC6: as VD7 on sheet RS-485; Manufacturer Part Number: USBLC6-2SC6; Component Type: Сборка диодная
ZQ1 = ASE-8.000MHZ-LC-T: Резонатор кварцевый 8.0 МГц; Manufacturer: Abracon; Component Type: Кварцевый генератор; Manufacturer Part Number: ASE-8.000MHZ-LC-T

## Nets that join several sheets
+3V3: Struct (9 pins), T1L_PHY (7 pins), RS-485 (6 pins), MCU (C20.1 L2.2)
+3V3MCU: Struct (R6.2 R7.2 R8.2 R9.2), T1L_PHY (R52.1), MCU (35 pins)
GND: Struct (21 pins), T1L_PHY (30 pins), RS-485 (5 pins), MCU (29 pins)
LED_G: Struct (HL6.2), T1L_PHY (DD2.29 R81.1)
CLK_IN: T1L_PHY (DD2.30), MCU (R39.1)
D_N: Struct (TP8.1 X1.45), MCU (L1.1 VD4.1 VD4.6)
D_P: Struct (TP12.1 X1.43), MCU (L1.4 VD4.3 VD4.4)
EXT_UART_RX: Struct (X1.39), MCU (DD1.43 TP22.1)
EXT_UART_TX: Struct (X1.37), MCU (DD1.42 TP21.1)
LED0: Struct (HL1.2), MCU (DD1.40 R47.2)
LED1: Struct (HL2.2), MCU (DD1.39)
LED2: Struct (HL3.2), MCU (DD1.38)
LED3: Struct (HL4.2), MCU (DD1.41 R48.2)
LED_Y: Struct (HL7.2), T1L_PHY (DD2.28 R72.1)
MCURXD0: T1L_PHY (R64.1), MCU (DD1.24)
MCURXD1: T1L_PHY (R59.1), MCU (DD1.25)
MCURXD2: T1L_PHY (R65.1), MCU (DD1.26)
MCURXD3: T1L_PHY (R60.1), MCU (DD1.27)
MDC: T1L_PHY (DD2.12), MCU (R15.1 R19.2 TP20.1)
MDIO: T1L_PHY (DD2.11), MCU (R14.1 R23.2 TP19.1)
MISO: Struct (TP4.1 X1.53), MCU (R20.1 R31.2 VD3.3 VD3.4)
MOSI: Struct (TP7.1 X1.51), MCU (R22.1 R24.2 VD2.1 VD2.6)
RS485_A: Struct (X1.8), RS-485 (5 pins)
RS485_B: Struct (X1.10), RS-485 (5 pins)
RST_PHY: T1L_PHY (DD2.31 R54.2), MCU (DD1.37)
RXC: T1L_PHY (R62.1), MCU (DD1.15)
RXDV: T1L_PHY (R61.1), MCU (DD1.23)
SCL: Struct (X1.33), MCU (R48.1)
SDA: Struct (X1.31), MCU (R47.1)
SPE_DATA_C_N: Struct (X1.24), T1L_PHY (C25.2 R69.2 TP39.1)
SPE_DATA_C_P: Struct (X1.22), T1L_PHY (C24.2 R68.2 TP38.1)
SPI_CLK: Struct (TP11.1 X1.55), MCU (R18.1 R28.2 VD3.1 VD3.6)
TXC: T1L_PHY (R63.1), MCU (DD1.11)
TXD0: T1L_PHY (DD2.24), MCU (R30.2)
TXD1: T1L_PHY (DD2.25), MCU (R17.1 R21.2)
TXD2: T1L_PHY (DD2.26), MCU (R33.2)
TXD3: T1L_PHY (DD2.27), MCU (R29.2)
TXEN: T1L_PHY (DD2.23), MCU (R12.1 R13.1)
UART_DE: RS-485 (DD3.2 DD3.3 R83.1), MCU (DD1.22)
UART_RX: RS-485 (DD3.1), MCU (DD1.59 TP24.1)
UART_TX: RS-485 (DD3.4), MCU (DD1.58 TP25.1)
VCC_SENSE: Struct (C3.2 R1.1 R2.2), MCU (DD1.8)
~I2C_INT: Struct (X1.29), MCU (R49.1)
~SPI_CS: Struct (TP14.1 X1.49), MCU (R16.1 R32.2 VD2.3 VD2.4)
~SPI_INT: Struct (TP16.1 X1.57), MCU (R36.1 R37.1)